# EAGLE design Control Board (EAGLE 9.6.2)
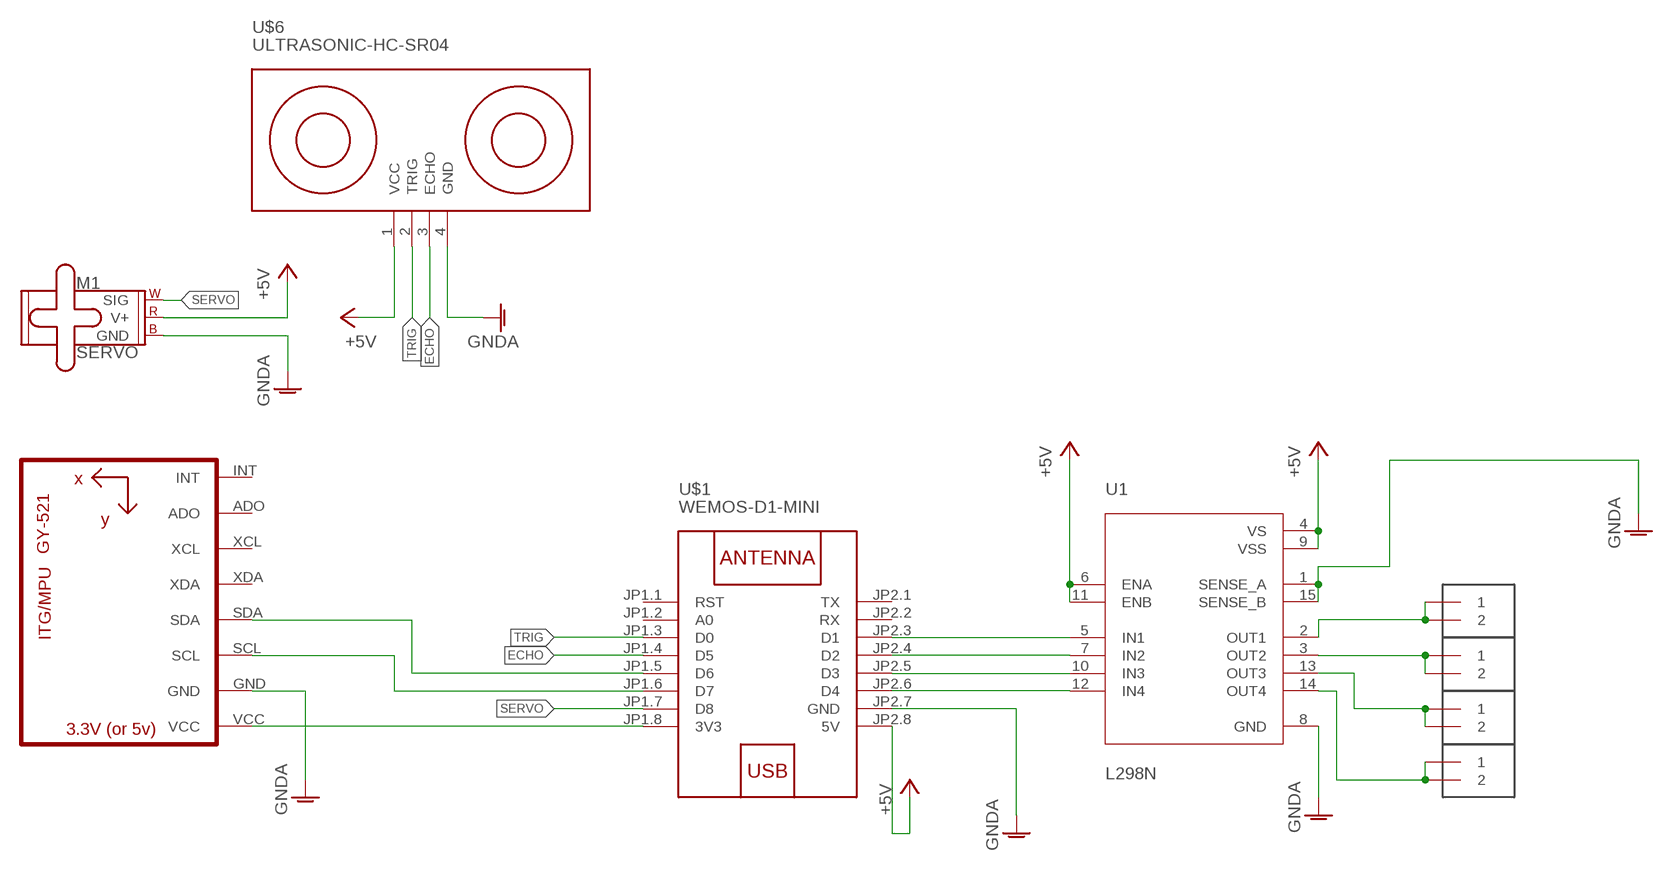
[diagram p0: schematic, sheet 1]

## Parts
M1  SERVO  [1X03]
U1  L298N  [TO127P2020X500X2100-15]
U2  GY-521MPU6050  [GY-521]
U$1  WEMOS-D1-MINI  [WEMOS-D1-MINI]
U$2  TERMINAL_2P  [KF301-2P]
U$3  TERMINAL_2P  [KF301-2P]
U$4  TERMINAL_2P  [KF301-2P]
U$5  TERMINAL_2P  [KF301-2P]
U$6  ULTRASONIC-HC-SR04  [ULTRASONIC-HC-SR04]

## Nets
+5V: M1.2(V+) U1.4(VS) U1.6(ENA) U1.9(VSS) U1.11(ENB) U$1.JP2.8(5V) U$6.1(VCC)
ECHO: U$1.JP1.4(D5) U$6.3(ECHO)
GNDA: M1.3(GND) U1.1(SENSE_A) U1.8(GND) U1.15(SENSE_B) U2.GND U$1.JP2.7(GND) U$6.4(GND)
N$1: U1.5(IN1) U$1.JP2.3(D1)
N$2: U1.7(IN2) U$1.JP2.4(D2)
N$3: U1.10(IN3) U$1.JP2.5(D3)
N$4: U1.12(IN4) U$1.JP2.6(D4)
N$5: U2.VCC U$1.JP1.8(3V3)
N$6: U2.SCL U$1.JP1.6(D7)
N$7: U2.SDA U$1.JP1.5(D6)
N$8: U1.14(OUT4) U$5.1 U$5.2
N$9: U1.13(OUT3) U$4.1 U$4.2
N$10: U1.3(OUT2) U$3.1 U$3.2
N$11: U1.2(OUT1) U$2.1 U$2.2
SERVO: M1.1(SIG) U$1.JP1.7(D8)
TRIG: U$1.JP1.3(D0) U$6.2(TRIG)
Unconnected: U2.ADO U2.INT U2.XCL U2.XDA U$1.JP1.1(RST) U$1.JP1.2(A0) U$1.JP2.1(TX) U$1.JP2.2(RX)

## Library data of the parts
M1 = SparkFun-Electromechanical:SERVO: Servo Motor 3-pin connector for a standard servo motor (voltage supply, ground, and control signal.) SparkFun Products Servo - Generic (Sub-Micro Size) <https://www.sparkfun.com/products/9065> (ROB-09065) Servo - Generic High Torque Continuous Rotation (Standard Size) <https://www.sparkfun.com/products/9347> (ROB-09347) Servo - Generic High Torque (Standard Size) <https://www.sparkfun.com/products/11965> (ROB-11965)
U1 = L298N:L298N: Dual Full Bridge Motor Driver 15-Pin(15+Tab) MULTIWATT V Tube Check availability <https://pricing.snapeda.com/parts/L298N/STMicroelectronics/view-part?ref=eda>; AVAILABILITY: In Stock; DESCRIPTION: Half Bridge (4) Driver DC Motors, Relays, Solenoids, Stepper Motors Bipolar 15-Multiwatt; MF: STMicroelectronics; MP: L298N; PACKAGE: Multiwatt-15 STMicroelectronics; PRICE: None; PURCHASE-URL: https://pricing.snapeda.com/search?q=L298N&ref=eda
U2 = gy-521:GY-521
U$1 = diy-modules:WEMOS-D1-MINI: WEMOS D1 mini: Mini Wi-Fi Board based on ESP-8266 device More details can be found here: https://www.wemos.cc/product/d1-mini.html Click here to find device on ebay.com <http://www.ebay.com/sch/wemos+d1+mini+nodemcu>
U$2-U$5 = KF301-2P-Terminal:TERMINAL_2P: Terminal Screw 2 Port 5mm Pitch
U$6 = diy-modules:ULTRASONIC-HC-SR04: Ultrasonic Ranging Module HC-SR04 More details available here: http://randomnerdtutorials.com/complete-guide-for-ultrasonic-sensor-hc-sr04/ Click here to find device on ebay.com <http://www.ebay.com/sch/hc+sr04+ultrasonic>

## Board
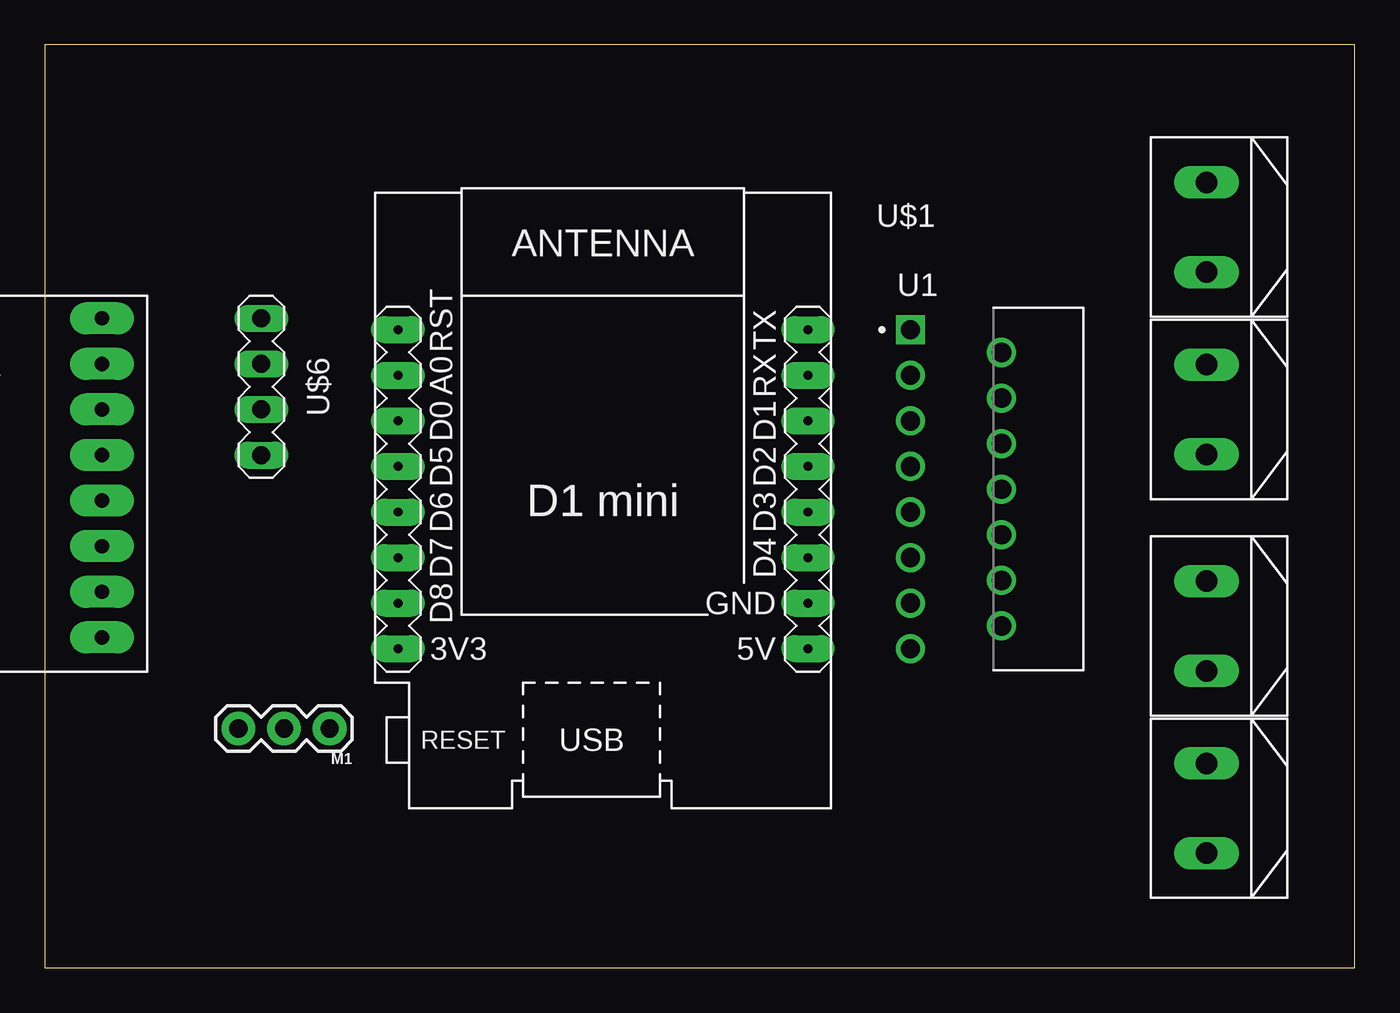
[diagram p1: board, top side]
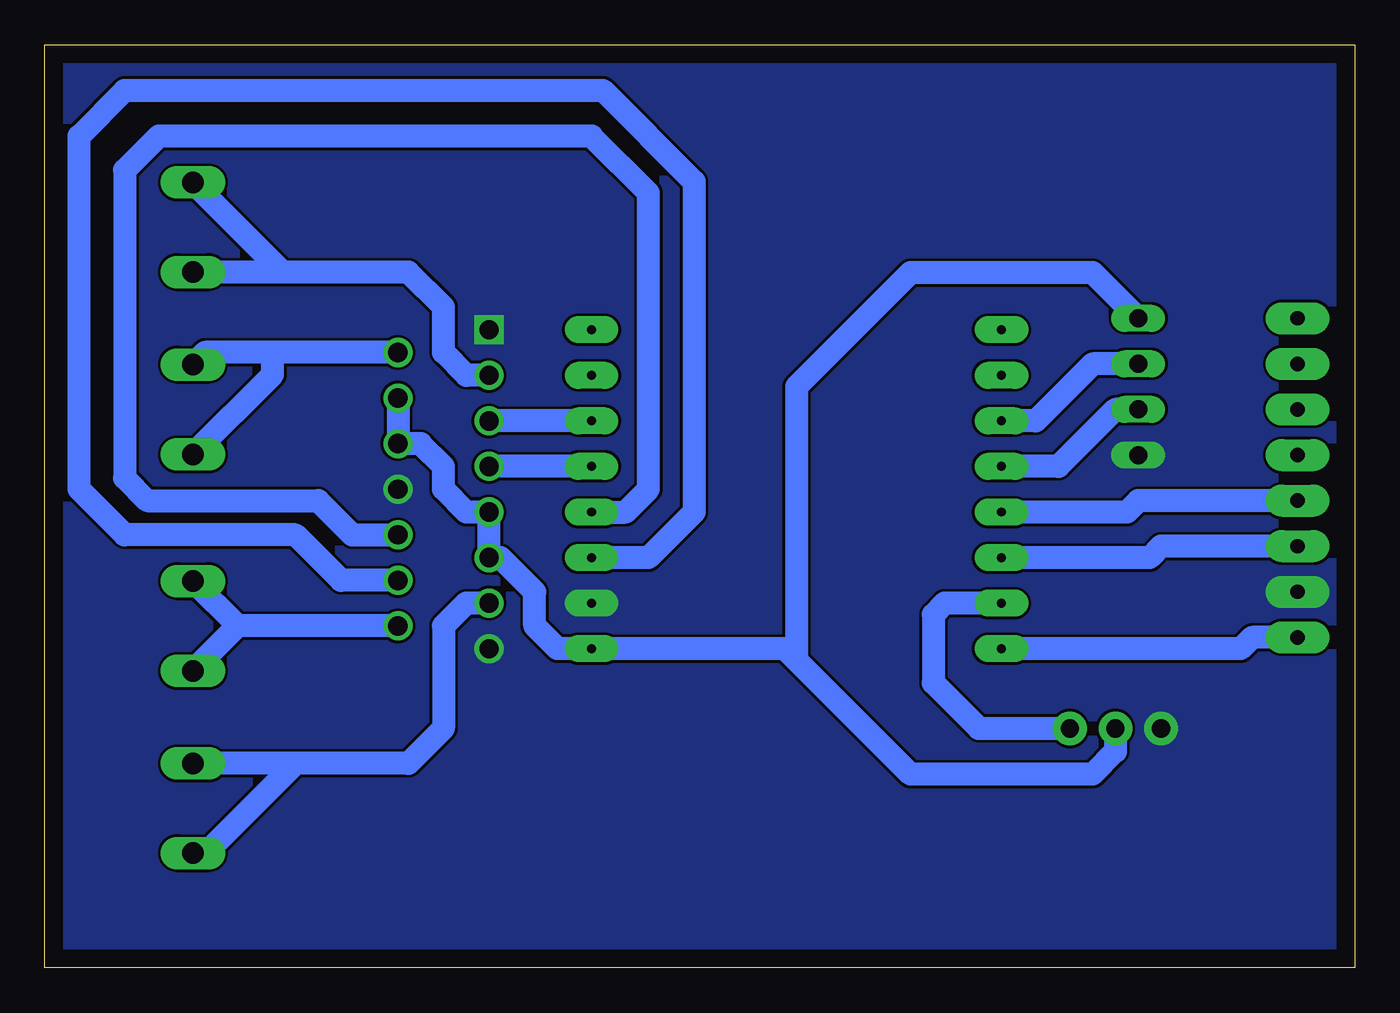
[diagram p2: board, bottom side, seen from below]

Size 73.03 x 51.44 mm. Coordinates in mm from the lower left corner, seen from the top.
Outline: 0,0 73.03,0 73.03,51.44 0,51.44 0,0
Copper layers (1*16): Top 0.035mm / dielectric 1.5mm / Bottom 0.035mm
Design rules "default": minimum track width 6mil, minimum drill 0.35mm, track to track 6mil, track to pad 6mil, pad to pad 6mil, via to via 6mil, smd to smd 6mil, copper to edge 40mil, drill to drill 6mil, minimum pad ring 10mil, minimum via ring 8mil, stop-mask expansion 4mil, vias tented up to drill 0mil, thermal gap 10mil

### Footprints (pad centres in the part's own frame; a part is rotated, then mirrored left to right if it is on the bottom)
1X03 = drill 1.016 pad 1.88: 1 0,0; 2 2.54,0; 3 5.08,0
TO127P2020X500X2100-15 = drill 1.08 pad 1.62 square: 1 0,0 | drill 1.08 pad 1.62: 2 5.08,-1.27; 3 0,-2.54; 4 5.08,-3.81; 5 0,-5.08; 6 5.08,-6.35; 7 0,-7.62; 8 5.08,-8.89; 9 0,-10.16; 10 5.08,-11.43; 11 0,-12.7; 12 5.08,-13.97; 13 0,-15.24; 14 5.08,-16.51; 15 0,-17.78
GY-521 = drill 0.8 pad 1.778 long: ADO -8.89,-6.35; GND -8.89,6.35; INT -8.89,-8.89; SCL -8.89,3.81; SDA -8.89,1.27; VCC -8.89,8.89; XCL -8.89,-3.81; XDA -8.89,-1.27
WEMOS-D1-MINI = drill 0.5 pad 1.5 long: JP1.1 -11.43,9.525; JP1.2 -11.43,6.985; JP1.3 -11.43,4.445; JP1.4 -11.43,1.905; JP1.5 -11.43,-0.635; JP1.6 -11.43,-3.175; JP1.7 -11.43,-5.715; JP1.8 -11.43,-8.255; JP2.1 11.43,9.525; JP2.2 11.43,6.985; JP2.3 11.43,4.445; JP2.4 11.43,1.905; JP2.5 11.43,-0.635; JP2.6 11.43,-3.175; JP2.7 11.43,-5.715; JP2.8 11.43,-8.255
KF301-2P = drill 1.2 pad 1.778 long: 1 -2.5,0; 2 2.5,0
ULTRASONIC-HC-SR04 = drill 1 long: 1 -3.81,0; 2 -1.27,0; 3 1.27,0; 4 3.81,0

### Placement (x,y rotation side)
M1  15.88,13.34 180 top
U1  48.26,35.56 0 top
U2  -5.71,27.3 180 top
U$1  31.11,26.04 0 top
U$2  64.77,31.11 90 top
U$3  64.77,41.27 90 top
U$4  64.77,8.89 90 top
U$5  64.77,19.05 90 top
U$6  12.06,32.38 270 top

### Tracks (layer width: path | path; a pad name or v marks a point on that pad's centre or on a via)
+5V
  Bottom 1.27: U$6.1 14.61,38.73 24.77,38.73 31.11,32.38 31.11,17.14 | M1.2 13.34,12.06 14.61,10.79 24.77,10.79 31.11,17.14 | U1.4 U1.6 52.07,29.21 50.8,27.94 50.8,26.67 49.53,25.4 U1.9 U1.11 47.62,22.86 45.72,20.95 45.72,19.05 44.45,17.78 U$1.JP2.8 31.75,17.78 31.11,17.14
ECHO
  Bottom 1.27: U$6.3 13.34,31.11 16.51,27.94 U$1.JP1.4
GNDA
  pour Bottom (isolate 0.127, no thermals): 0,0 0,51.44 73.03,51.44 73.03,0
N$1
  Bottom 1.27: U$1.JP2.3 U1.5
N$2
  Bottom 1.27: U$1.JP2.4 U1.7
N$3
  Bottom 1.27: U$1.JP2.5 40.64,25.4 39.37,26.67 39.37,43.18 42.55,46.35 66.67,46.35 68.58,44.45 68.58,27.3 67.31,26.04 57.78,26.04 55.88,24.13 U1.10
N$4
  Bottom 1.27: U1.12 56.52,21.59 59.05,24.13 68.58,24.13 71.12,26.67 71.12,46.35 68.58,48.9 41.91,48.9 36.83,43.81 36.83,25.4 39.37,22.86 U$1.JP2.6
N$5
  Bottom 1.27: U2.VCC 5.71,18.41 6.35,17.78 U$1.JP1.8
N$6
  Bottom 1.27: U2.SCL 10.79,23.5 11.43,22.86 U$1.JP1.6
N$7
  Bottom 1.27: U2.SDA 12.06,26.04 12.7,25.4 U$1.JP1.5
N$8
  Bottom 1.27: U1.14 62.27,19.05 | 62.27,19.05 U$5.1 | U$5.2 62.27,19.05
N$9
  Bottom 1.27: U1.13 49.53,20.32 50.8,19.05 50.8,13.34 52.74,11.39 59.05,11.39 | 59.05,11.39 U$4.2 | U$4.1 64.06,6.39 59.05,11.39
N$10
  Bottom 1.27: U1.3 49.53,33.02 50.8,34.29 50.8,36.83 52.74,38.77 59.77,38.77 | 59.77,38.77 U$3.1 | U$3.2 59.77,38.77
N$11
  Bottom 1.27: U1.2 60.33,34.29 | 60.33,34.29 64.09,34.29 U$2.2 | U$2.1 60.33,33.06 60.33,34.29
SERVO
  Bottom 1.27: U$1.JP1.7 22.86,20.32 23.5,19.68 23.5,15.88 20.95,13.34 M1.1
TRIG
  Bottom 1.27: U$6.2 14.61,33.66 17.78,30.48 U$1.JP1.3